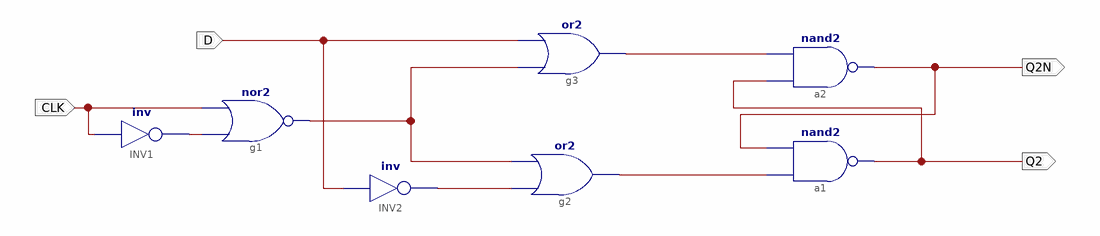
[diagram p0: schematic sheet 1]
// Xilinx ISE schematic SamiFronteDiscesa.sch (spartan3e) as structural Verilog: 7 symbols, 4 ports
module SamiFronteDiscesa (
  input  D,
  input  CLK,
  output Q2N,
  output Q2
);

  wire Q, Q1, XLXN_10, XLXN_23, XLXN_26;

  nand a2 (Q2N, Q2, Q);
  nand a1 (Q2, Q1, Q2N);
  or g3 (Q, XLXN_23, D);
  or g2 (Q1, XLXN_10, XLXN_23);
  not INV2 (XLXN_10, D);
  nor g1 (XLXN_23, XLXN_26, CLK);
  not INV1 (XLXN_26, CLK);
endmodule
